# EAGLE design wind direction (EAGLE 9.4.2)
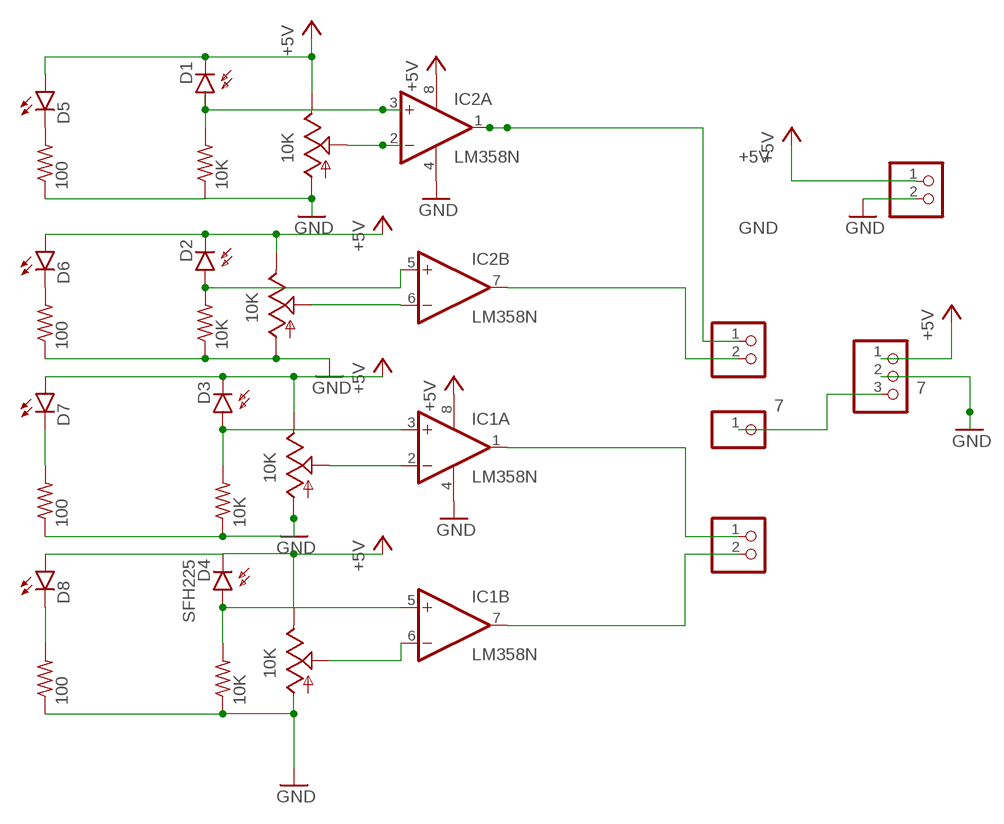
[diagram p0: schematic, sheet 1]

## Parts
D1  SFH225  [SFH225]
D2  SFH225  [SFH225]
D3  SFH225  [SFH225]
D4  SFH225  [SFH225]
D5  SFH482  [SFH482]
D6  SFH482  [SFH482]
D7  SFH482  [SFH482]
D8  SFH482  [SFH482]
IC1  LM358N  [DIL08]
IC2  LM358N  [DIL08]
JP1  PINHD-1X2  [1X02]
JP2  PINHD-1X2  [1X02]
JP3  PINHD-1X2  [1X02]
JP4  PINHD-1X3  [1X03]
JP5  PINHD-1X1  [1X01]
R1  10K  R-US_0411/15  [0411/15]
R2  100  R-US_0411/15  [0411/15]
R3  10K  R-US_0411/15  [0411/15]
R4  100  R-US_0411/15  [0411/15]
R5  10K  R-US_0411/15  [0411/15]
R6  100  R-US_0411/15  [0411/15]
R7  100  R-US_0411/15  [0411/15]
R8  10K  R-US_0411/15  [0411/15]
R9  10K  TRIM_US-CA14V  [CA14V]
R10  10K  TRIM_US-CA14V  [CA14V]
R11  10K  TRIM_US-CA14V  [CA14V]
R12  10K  TRIM_US-CA14V  [CA14V]

## Nets
7: JP4.3 JP5.1
+5V: D1.K(C) D2.K(C) D3.K(C) D4.K(C) D5.A D6.A D7.A D8.A IC1.8(P:V+) IC2.8(P:V+) JP2.1 JP4.1 R9.E R10.E R11.E R12.E
GND: IC1.4(P:V-) IC2.4(P:V-) JP2.2 JP4.2 R1.1 R2.1 R3.1 R4.1 R5.1 R6.1 R7.1 R8.1 R9.A R10.A R11.A R12.A
N$1: D3.A IC1.3(A:+IN) R5.2
N$2: D7.K(C) R6.2
N$3: D2.A IC2.5(B:+IN) R3.2
N$4: D6.K(C) R4.2
N$5: D5.K(C) R2.2
N$6: IC2.2(A:-IN) R9.S
N$7: D1.A IC2.3(A:+IN) R1.2
N$9: IC2.7(B:OUT) JP1.2
N$10: IC1.1(A:OUT) JP3.1
N$11: IC1.7(B:OUT) JP3.2
N$12: IC2.6(B:-IN) R10.S
N$13: D8.K(C) R7.2
N$14: IC2.1(A:OUT) JP1.1
N$15: IC1.2(A:-IN) R11.S
N$17: D4.A IC1.5(B:+IN) R8.2
N$18: IC1.6(B:-IN) R12.S

## Library data of the parts
D1-D4 = opto-trans-siemens:SFH225: PHOTO DIODE; OC_FARNELL: unknown; OC_NEWARK: unknown
D5-D8 = led:SFH482: IR LED infrared emitting diode, Infineon
IC1 IC2 = linear:LM358: OP AMP also LM158; LM258; LM2904 Source: http://cache.national.com/ds/LM/LM158.pdf
JP1-JP3 = pinhead:PINHD-1X2: PIN HEADER
JP4 = pinhead:PINHD-1X3: PIN HEADER
JP5 = pinhead:PINHD-1X1: PIN HEADER
R1-R8 = rcl:R-US_: RESISTOR, American symbol; SPICEPREFIX: R
R9-R12 = pot:TRIM_US-: POTENTIOMETER

## Board
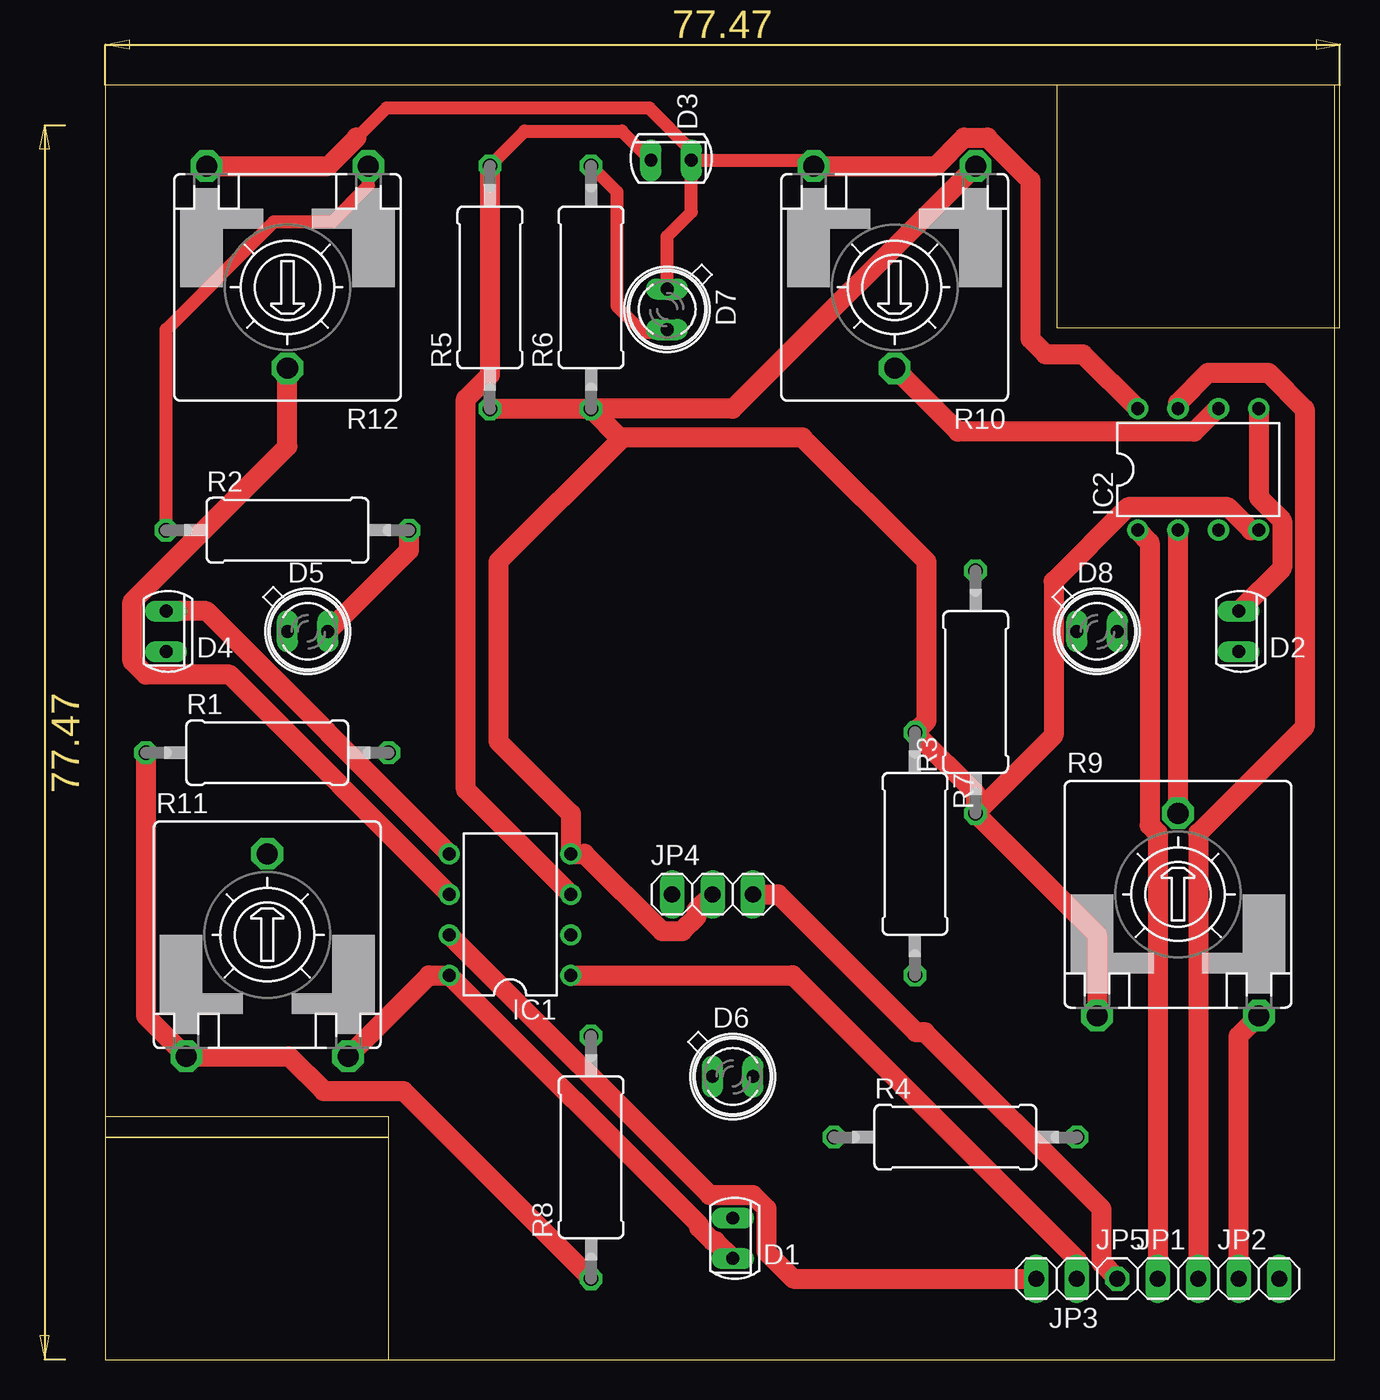
[diagram p1: board, top side]
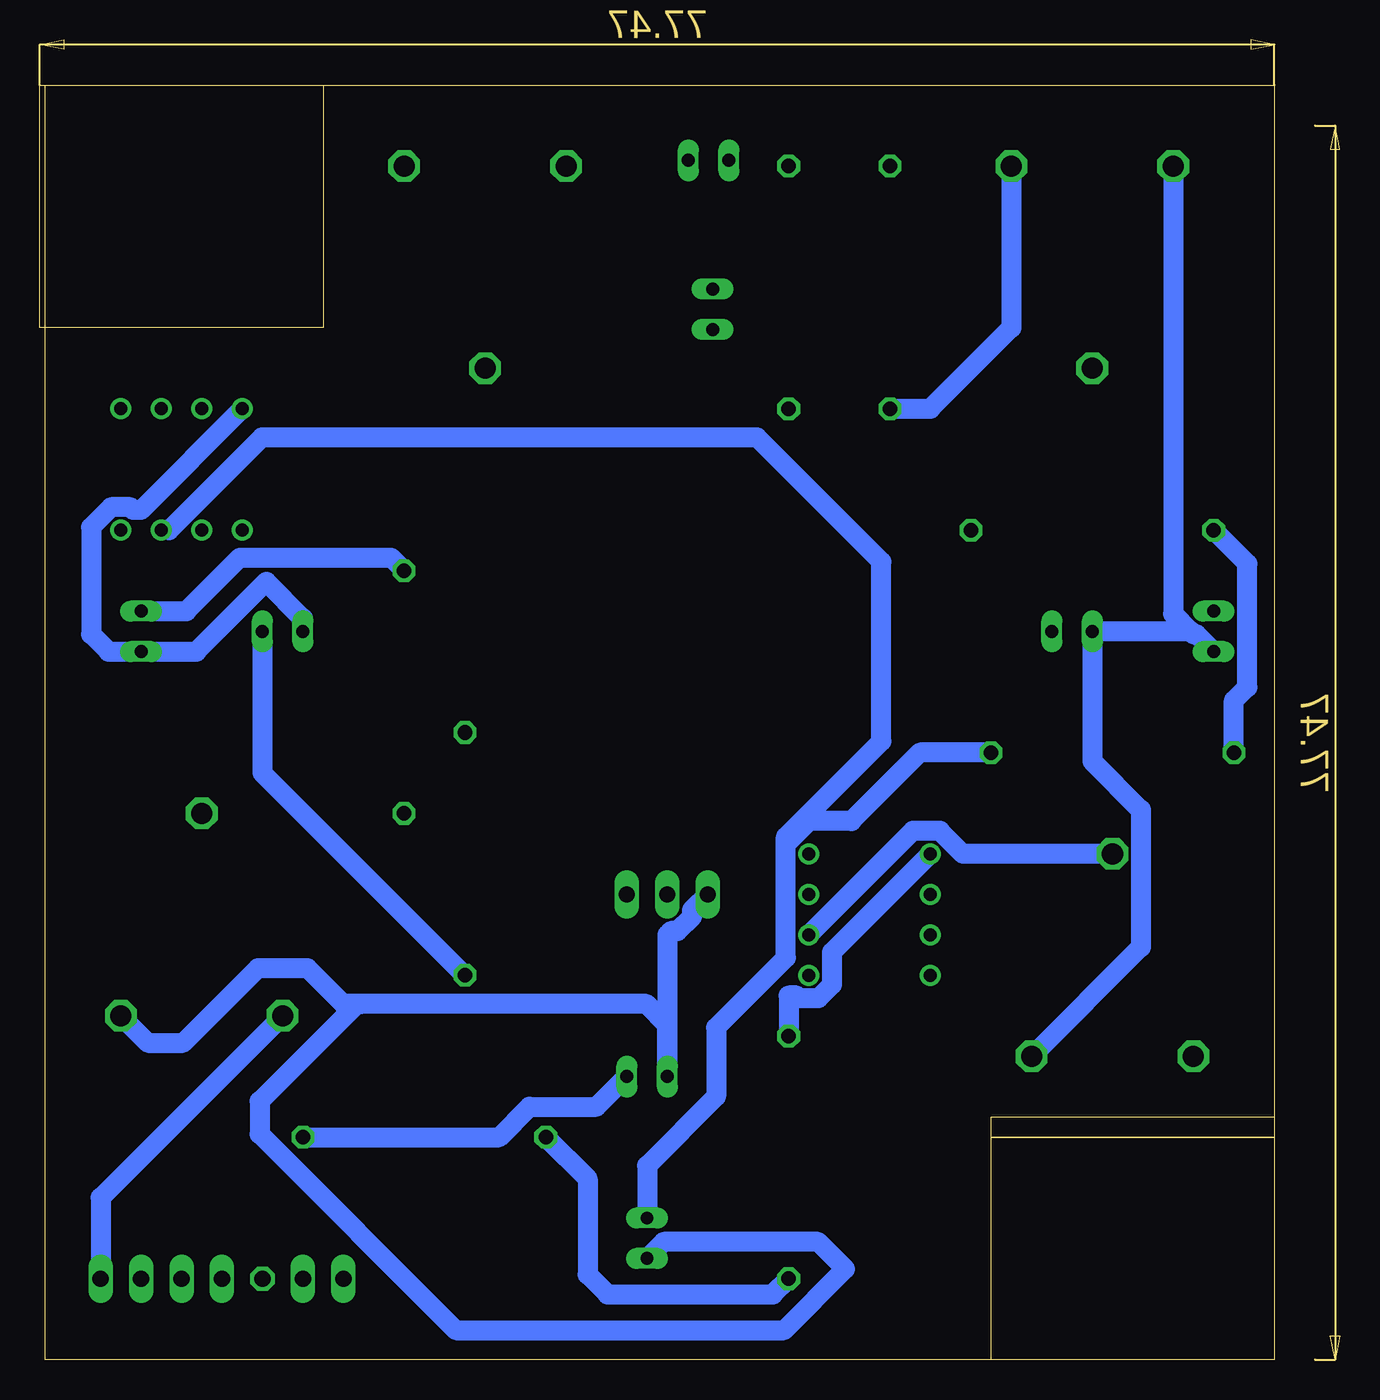
[diagram p2: board, bottom side, seen from below]

Size 77.47 x 80.01 mm. Coordinates in mm from the lower left corner, seen from the top.
Outline: 0,0 77.14,0 77.14,80 0,80 0,0
Copper layers (1*16): Top 0.035mm / dielectric 1.5mm / Bottom 0.035mm
Design rules "default": minimum track width 6mil, minimum drill 0.35mm, track to track 6mil, track to pad 6mil, pad to pad 6mil, via to via 6mil, smd to smd 6mil, copper to edge 40mil, drill to drill 6mil, minimum pad ring 10mil, minimum via ring 8mil, stop-mask expansion 4mil, vias tented up to drill 0mil, thermal gap 10mil

### Footprints (pad centres in the part's own frame; a part is rotated, then mirrored left to right if it is on the bottom)
SFH225 = drill 0.813 long: A 0,1.27; K 0,-1.27
SFH482 = drill 0.813 long: A -1.27,0; K 1.27,0
DIL08 = drill 0.813 pad 1.27: 1 -3.81,-3.81; 2 -1.27,-3.81; 3 1.27,-3.81; 4 3.81,-3.81; 5 3.81,3.81; 6 1.27,3.81; 7 -1.27,3.81; 8 -3.81,3.81
1X02 = drill 1.016 long: 1 -1.27,0; 2 1.27,0
1X03 = drill 1.016 long: 1 -2.54,0; 2 0,0; 3 2.54,0
1X01 = drill 1.016 octagon: 1 0,0
0411/15 = drill 0.914 octagon: 1 -7.62,0; 2 7.62,0
CA14V = drill 1.321 octagon: A -5.08,-7.62; E 5.08,-7.62; S 0,5.08

### Placement (x,y rotation side)
D1  39.37,7.62 0 top
D2  71.12,45.72 0 top
D3  35.51,75.29 90 top
D4  3.81,45.72 0 top
D5  12.7,45.72 0 top
D6  39.37,17.78 0 top
D7  35.26,65.94 270 top
D8  62.23,45.72 0 top
IC1  25.4,27.94 90 top
IC2  68.58,55.88 0 top
JP1  67.31,5.08 0 top
JP2  72.39,5.08 0 top
JP3  59.69,5.08 180 top
JP4  38.1,29.21 0 top
JP5  63.5,5.08 0 top
R1  10.16,38.1 0 top
R2  11.43,52.07 0 top
R3  54.61,41.91 90 top
R4  53.34,13.97 0 top
R5  24.13,67.31 90 top
R6  30.48,67.31 90 top
R7  50.8,31.75 270 top
R8  30.48,12.7 90 top
R9  67.31,29.21 0 top
R10  49.53,67.31 180 top
R11  10.16,26.67 0 top
R12  11.43,67.31 180 top

### Tracks (layer width: path | path; a pad name or v marks a point on that pad's centre or on a via)
7
  Top 1.27: JP5.1 62.51,6.07 62.51,9.46 51.42,20.55 50.88,20.55 42.22,29.21 JP4.3
+5V
  Top 0.813: D7.A 35.26,70.51 36.78,72.03 D3.K | D3.K 44.09,75.29 R10.E | 15.77,76.71 17.64,78.58 34.14,78.58 36.78,75.94 D3.K
  Top 1.27: D1.K 38.28,7.44 38.11,7.44 37.26,8.29 37.26,8.46 IC1.8 20.32,24.13 R11.E | R12.E 14,74.93 15.77,76.71 | IC2.8 61.34,63.12 59.01,63.12 58.04,64.09 58.04,74.02 55.35,76.71 53.87,76.71 52.1,74.93 R10.E | JP2.1 71.12,20.32 R9.E
  Bottom 0.813: 57.57,22.33 57.3,22.33 | 71.61,53.34 71.79,53.52
  Bottom 1.27: 5.25,45.72 5.07,45.54 4.9,45.54 D4.K | 5.25,45.72 D5.A 11.43,37.57 8.38,34.52 8.38,25.91 R11.E | R12.E 6.35,46.82 5.25,45.72 | IC2.8 71.12,53.34 71.61,53.34 | 71.79,53.52 72.99,53.52 74.24,52.26 74.24,45.54 73.15,44.45 D2.K 67.65,44.45 63.26,48.83 60.96,46.53 D8.A | JP4.1 36.55,28.22 36.55,27.81 37.46,26.9 37.87,26.9 38.1,26.67 D6.A 38.1,21.03 39.4,22.33 57.3,22.33 58.42,22.33 60.68,24.59 63.78,24.59 68.48,19.89 70.69,19.89 R9.E | 57.57,22.33 63.68,16.22 63.68,14.16 51.37,1.85 30.77,1.85 26.94,5.69 28.64,7.39 38.33,7.39 D1.K
GND
  Top 0.813: R2.1 3.81,64.67 10.57,71.43 14.22,71.43 16.51,73.71 R12.A
  Top 1.27: JP4.2 37.11,28.22 37.11,27.81 36.2,26.9 34.92,26.9 30.07,31.75 IC1.4 29.21,34.27 24.66,38.81 24.66,50.09 32.46,57.89 | R8.1 18.69,16.87 13.69,16.87 11.51,19.05 R11.A 2.54,21.59 R1.1 | R5.1 R6.1 | R10.A 39.37,59.69 R6.1 | R3.1 59.51,39.19 59.51,48.86 64.17,53.52 70.45,53.52 71.9,52.07 IC2.4 | R3.1 62.23,26.67 R9.A | R3.1 54.61,35.56 R7.1 51.54,40.11 51.54,50.09 43.74,57.89 32.46,57.89 | R6.1 32.28,57.89 32.46,57.89
  Bottom 1.27: R1.1 2.54,41.39 1.7,42.23 1.7,49.96 R2.1 | R5.1 21.59,59.69 16.51,64.77 R12.A | R9.A 73.66,10.16 JP2.2 | R4.1 43.1,11.35 43.1,5.34 41.85,4.09 31.47,4.09 R8.1
N$1
  Top 0.813: R5.2 26.31,77.11 32.41,77.11 D3.A
  Top 1.27: IC1.3 22.63,35.79 22.63,60.31 24.13,61.81 R5.2
N$2
  Top 0.813: R6.2 32.11,73.3 32.11,66.14 33.73,64.52 35.1,64.52 D7.K
N$3
  Top 1.27: IC2.5 72.39,54.12 73.84,52.67 73.84,49.71 D2.A
  Bottom 1.27: R3.2 55.42,50.34 64.92,50.34 68.28,46.99 D2.A
N$4
  Bottom 1.27: R4.2 48.65,13.97 46.75,15.88 42.55,15.88 D6.K
N$5
  Top 1.27: R2.2 19.05,50.8 D5.K
N$6
  Top 1.27: R9.S IC2.2
N$7
  Bottom 1.27: R1.2 22.25,38.1 26.54,33.81 29.2,33.81 30.66,32.35 | D1.A 39.37,12.18 35.03,16.52 35.03,20.85 30.66,25.22 30.66,32.35 | IC2.3 69.36,52.07 63.54,57.89 32.46,57.89 24.66,50.09 24.66,38.81 30.66,32.82 30.66,32.35
N$9
  Top 1.27: JP1.2 68.58,33.05 75.26,39.73 75.26,59.68 72.99,61.95 69.2,61.95 67.31,60.06 IC2.7
N$10
  Top 1.27: IC1.1 43.13,24.13 60.96,6.3 JP3.1
N$11
  Top 1.27: JP3.2 43.18,5.08 41.48,6.78 41.48,9.49 40.63,10.34 37.92,10.34 IC1.7
N$12
  Top 1.27: IC2.6 69.76,59.69 68.32,58.24 53.52,58.24 R10.S
N$13
  Bottom 1.27: D8.K 63.5,36.83 R7.2
N$14
  Top 1.27: JP1.1 66.04,33.05 65.53,33.55 65.53,51.31 IC2.1
N$15
  Bottom 1.27: R11.S 19.54,31.75 20.99,33.2 22.68,33.2 IC1.2
N$17
  Top 1.27: IC1.5 6.35,46.99 D4.A
  Bottom 1.27: R8.2 30.48,22.86 29.99,22.86 29.81,22.68 28.61,22.68 27.76,23.53 27.76,25.58 IC1.5
N$18
  Top 1.27: R12.S 11.43,57.32 1.7,47.59 1.7,43.85 2.55,43 7.8,43 IC1.6